# Altium schematic sheet SPD Breakout V2.SchDoc
size A4; SheetNumber: 1; SheetTotal: 2
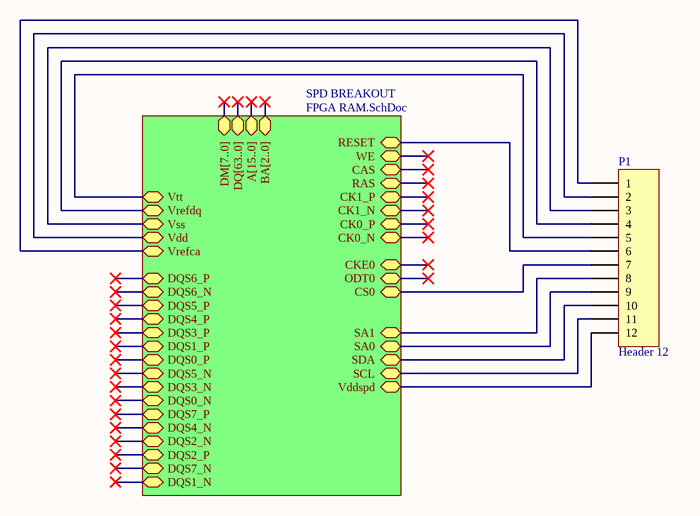
[diagram p0: SPD Breakout V2.SchDoc]

## Parts
P1  Header 12  [HDR1X12]

## Sub-sheets
SPD BREAKOUT = FPGA RAM.SchDoc: DM[7..0] (bidir), DQ[63..0] (bidir), Vrefdq (bidir), Vss (bidir), Vdd (bidir), Vrefca (bidir), DQS6_P (bidir), DQS6_N (bidir), DQS5_P (bidir), DQS4_P (bidir), DQS3_P (bidir), DQS1_P (bidir), DQS0_P (bidir), DQS5_N (bidir), DQS3_N (bidir), DQS0_N (bidir), DQS7_P (bidir), DQS4_N (bidir), DQS2_N (bidir), DQS2_P (bidir), DQS7_N (bidir), DQS1_N (bidir), A[15..0] (bidir), BA[2..0] (bidir), WE (bidir), CAS (bidir), RAS (bidir), Vtt (bidir), RESET (bidir), CK0_P (bidir), CK0_N (bidir), CKE0 (bidir), ODT0 (bidir), CS0 (bidir), SA1 (bidir), SA0 (bidir), SDA (bidir), SCL (bidir), Vddspd (bidir), CK1_P (bidir), CK1_N (bidir)

## Nets
NetP1_1: P1.1 ; sheet SPD BREAKOUT/Vrefca
NetP1_2: P1.2 ; sheet SPD BREAKOUT/Vdd
NetP1_3: P1.3 ; sheet SPD BREAKOUT/Vss
NetP1_4: P1.4 ; sheet SPD BREAKOUT/Vrefdq
NetP1_5: P1.5 ; sheet SPD BREAKOUT/Vtt
NetP1_6: P1.6 ; sheet SPD BREAKOUT/RESET
NetP1_7: P1.7 ; sheet SPD BREAKOUT/CS0
NetP1_8: P1.8 ; sheet SPD BREAKOUT/SA1
NetP1_9: P1.9 ; sheet SPD BREAKOUT/SA0
NetP1_10: P1.10 ; sheet SPD BREAKOUT/SDA
NetP1_11: P1.11 ; sheet SPD BREAKOUT/SCL
NetP1_12: P1.12 ; sheet SPD BREAKOUT/Vddspd

## Library data of the parts
P1 = Header 12: Header, 12-Pin; LatestRevisionDate: 17-Jul-2002; LatestRevisionNote: Re-released for DXP Platform.; Publisher: Altium Limited